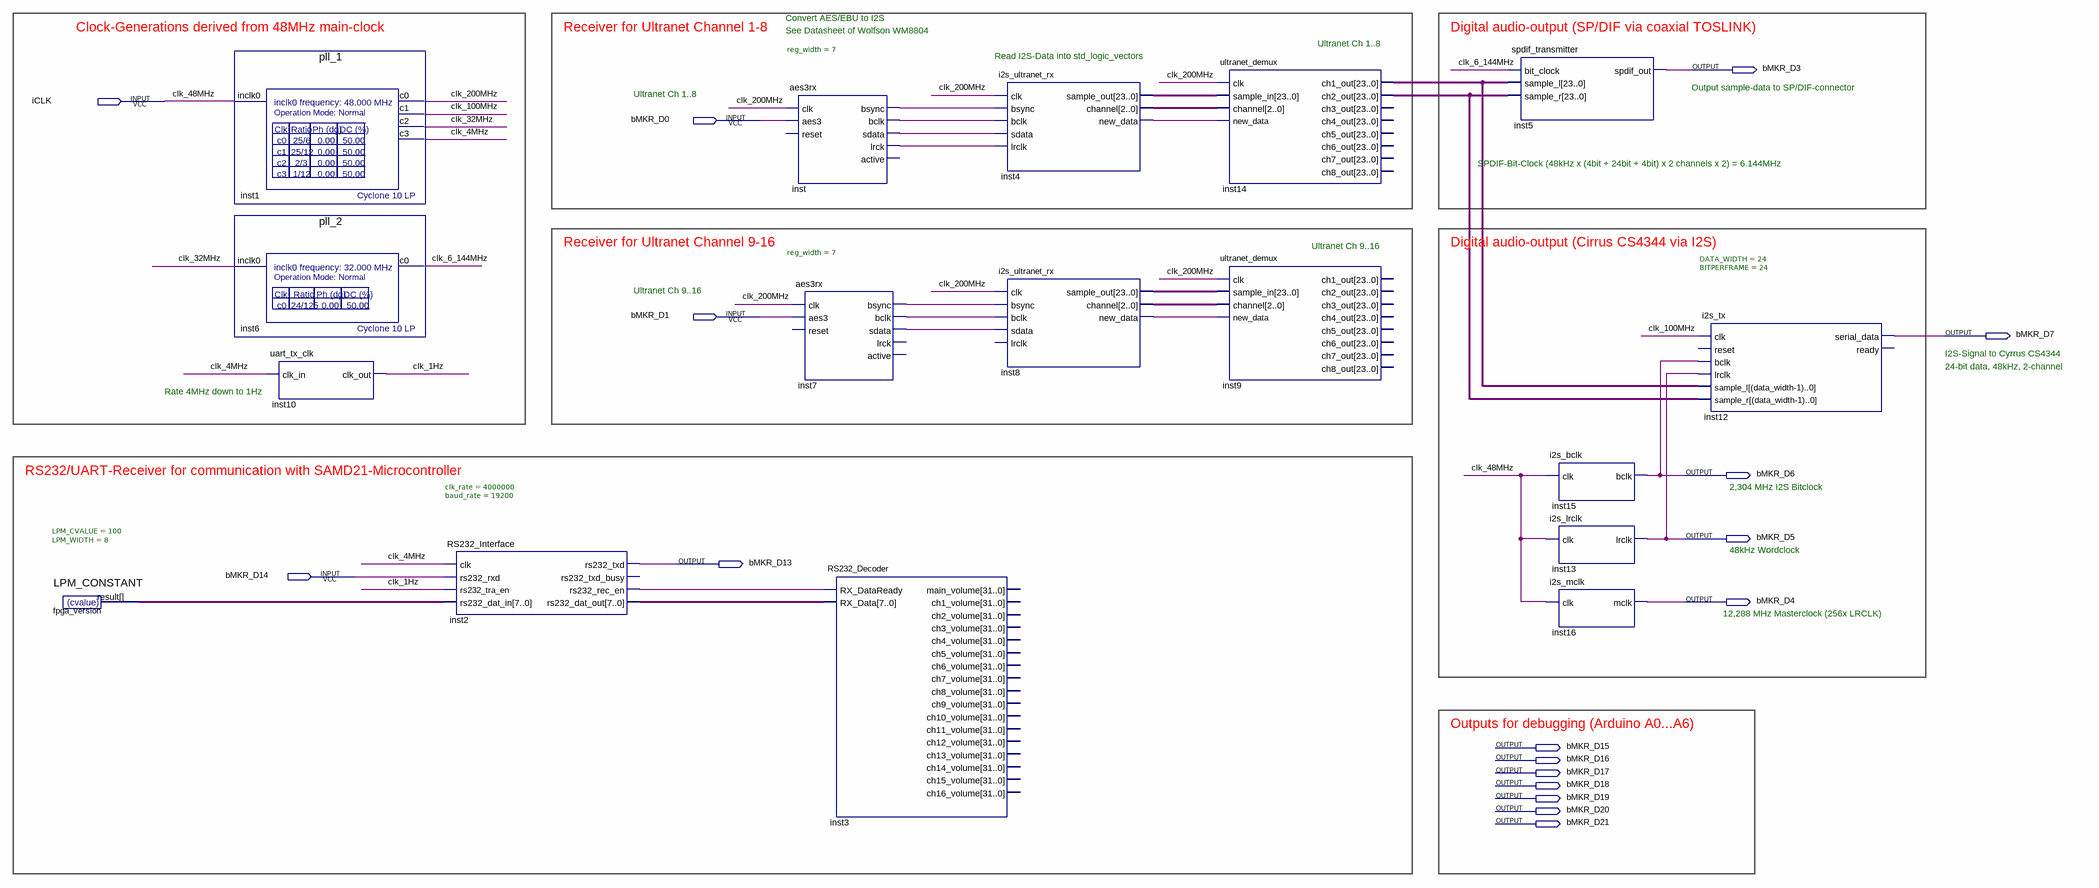
[diagram p0: schematic sheet]
// Quartus schematic UltranetReceiver.bdf as structural Verilog: 17 symbols, 17 pins
module UltranetReceiver (
  input  iCLK,
  input  bMKR_D0,
  input  bMKR_D1,
  input  bMKR_D14,
  output bMKR_D3,
  output bMKR_D7,
  output bMKR_D6,
  output bMKR_D5,
  output bMKR_D13,
  output bMKR_D4,
  output bMKR_D15,
  output bMKR_D16,
  output bMKR_D17,
  output bMKR_D18,
  output bMKR_D19,
  output bMKR_D20,
  output bMKR_D21
);

  wire clk_1Hz, clk_4MHz, clk_6_144MHz, clk_32MHz, clk_100MHz, clk_200MHz, inst2_rs232_rec_en,
       inst4_new_data, inst7_bclk, inst7_bsync, inst7_sdata, inst8_new_data, inst_bclk, inst_bsync,
       inst_lrck, inst_sdata;
  wire [2:0] inst4_channel, inst8_channel;
  wire [7:0] fpga_version_result, inst2_rs232_dat_out;
  wire [23:0] inst4_sample_out, inst8_sample_out, inst14_ch1_out, inst14_ch2_out;

  LPM_CONSTANT #(.LPM_CVALUE(100), .LPM_WIDTH(8)) fpga_version (.result(fpga_version_result));
  pll_1 inst1 (.inclk0(iCLK), .c0(clk_200MHz), .c1(clk_100MHz), .c2(clk_32MHz), .c3(clk_4MHz));
  pll_2 inst6 (.inclk0(clk_32MHz), .c0(clk_6_144MHz));
  uart_tx_clk inst10 (.clk_in(clk_4MHz), .clk_out(clk_1Hz));
  RS232_Interface #(.clk_rate(4000000), .baud_rate(19200)) inst2 (
    .clk(clk_4MHz), .rs232_rxd(bMKR_D14), .rs232_tra_en(clk_1Hz), .rs232_dat_in(fpga_version_result),
    .rs232_txd(bMKR_D13), .rs232_rec_en(inst2_rs232_rec_en), .rs232_dat_out(inst2_rs232_dat_out));  // open: rs232_txd_busy
  aes3rx #(.reg_width(7)) inst (
    .clk(clk_200MHz), .aes3(bMKR_D0), .bsync(inst_bsync), .bclk(inst_bclk), .sdata(inst_sdata),
    .lrck(inst_lrck));  // open: reset, active
  aes3rx #(.reg_width(7)) inst7 (
    .clk(clk_200MHz), .aes3(bMKR_D1), .bsync(inst7_bsync), .bclk(inst7_bclk), .sdata(inst7_sdata));  // open: reset, lrck, active
  RS232_Decoder inst3 (
    .RX_DataReady(inst2_rs232_rec_en), .RX_Data(inst2_rs232_dat_out));  // open: main_volume, ch1_volume, ch2_volume, ch3_volume, ch4_volume, ch5_volume, ch6_volume, ch7_volume, ch8_volume, ch9_volume, ch10_volume, ch11_volume, ch12_volume, ch13_volume, ch14_volume, ch15_volume, ch16_volume
  i2s_ultranet_rx inst4 (
    .clk(clk_200MHz), .bsync(inst_bsync), .bclk(inst_bclk), .sdata(inst_sdata), .lrclk(inst_lrck),
    .sample_out(inst4_sample_out), .channel(inst4_channel), .new_data(inst4_new_data));
  i2s_ultranet_rx inst8 (
    .clk(clk_200MHz), .bsync(inst7_bsync), .bclk(inst7_bclk), .sdata(inst7_sdata),
    .sample_out(inst8_sample_out), .channel(inst8_channel), .new_data(inst8_new_data));  // open: lrclk
  ultranet_demux inst14 (
    .clk(clk_200MHz), .sample_in(inst4_sample_out), .channel(inst4_channel), .new_data(inst4_new_data),
    .ch1_out(inst14_ch1_out), .ch2_out(inst14_ch2_out));  // open: ch3_out, ch4_out, ch5_out, ch6_out, ch7_out, ch8_out
  ultranet_demux inst9 (
    .clk(clk_200MHz), .sample_in(inst8_sample_out), .channel(inst8_channel), .new_data(inst8_new_data));  // open: ch1_out, ch2_out, ch3_out, ch4_out, ch5_out, ch6_out, ch7_out, ch8_out
  spdif_transmitter inst5 (
    .bit_clock(clk_6_144MHz), .sample_l(inst14_ch1_out), .sample_r(inst14_ch2_out), .spdif_out(bMKR_D3));
  i2s_bclk inst15 (.clk(iCLK), .bclk(bMKR_D6));
  i2s_lrclk inst13 (.clk(iCLK), .lrclk(bMKR_D5));
  i2s_mclk inst16 (.clk(iCLK), .mclk(bMKR_D4));
  i2s_tx #(.DATA_WIDTH(24), .BITPERFRAME(24)) inst12 (
    .clk(clk_100MHz), .bclk(bMKR_D6), .lrclk(bMKR_D5), .sample_l(inst14_ch1_out), .sample_r(inst14_ch2_out),
    .serial_data(bMKR_D7));  // open: reset, ready

  // Other names for the same wires on the sheet: clk_48MHz = iCLK

  // Notes on the sheet:
  //   Convert AES/EBU to I2S
  //   Clock-Generations derived from 48MHz main-clock
  //   Receiver for Ultranet Channel 1-8
  //   Digital audio-output (SP/DIF via coaxial TOSLINK)
  //   See Datasheet of Wolfson WM8804
  //   Ultranet Ch 1..8
  //   Read I2S-Data into std_logic_vectors
  //   Output sample-data to SP/DIF-connector
  //   Ultranet Ch 1..8
  //   SPDIF-Bit-Clock (48kHz x (4bit + 24bit + 4bit) x 2 channels x 2) = 6.144MHz
  //   Receiver for Ultranet Channel 9-16
  //   Digital audio-output (Cirrus CS4344 via I2S)
  //   Ultranet Ch 9..16
  //   Ultranet Ch 9..16
  //   I2S-Signal to Cyrrus CS4344
  //   24-bit data, 48kHz, 2-channel
  //   Rate 4MHz down to 1Hz
  //   RS232/UART-Receiver for communication with SAMD21-Microcontroller
  //   2,304 MHz I2S Bitclock
  //   48kHz Wordclock
  //   12,288 MHz Masterclock (256x LRCLK)
  //   Outputs for debugging (Arduino A0...A6)
endmodule
